# EasyEDA Pro project Batman_Forever_JAMMA_Adapter_V1.2.eprj

# Schematic Batman_Adapter
Board Name: Batman_Adapter; Create Date: 2026-03-11; Page Name: Batman_Adapter; Project Name: Batman_Forever_JAMMA_Adapter_V1.2; Schematic Name: Batman_Adapter; Update Date: 2026-03-10; File: Batman_Adapter; Id: /; Sheet: /
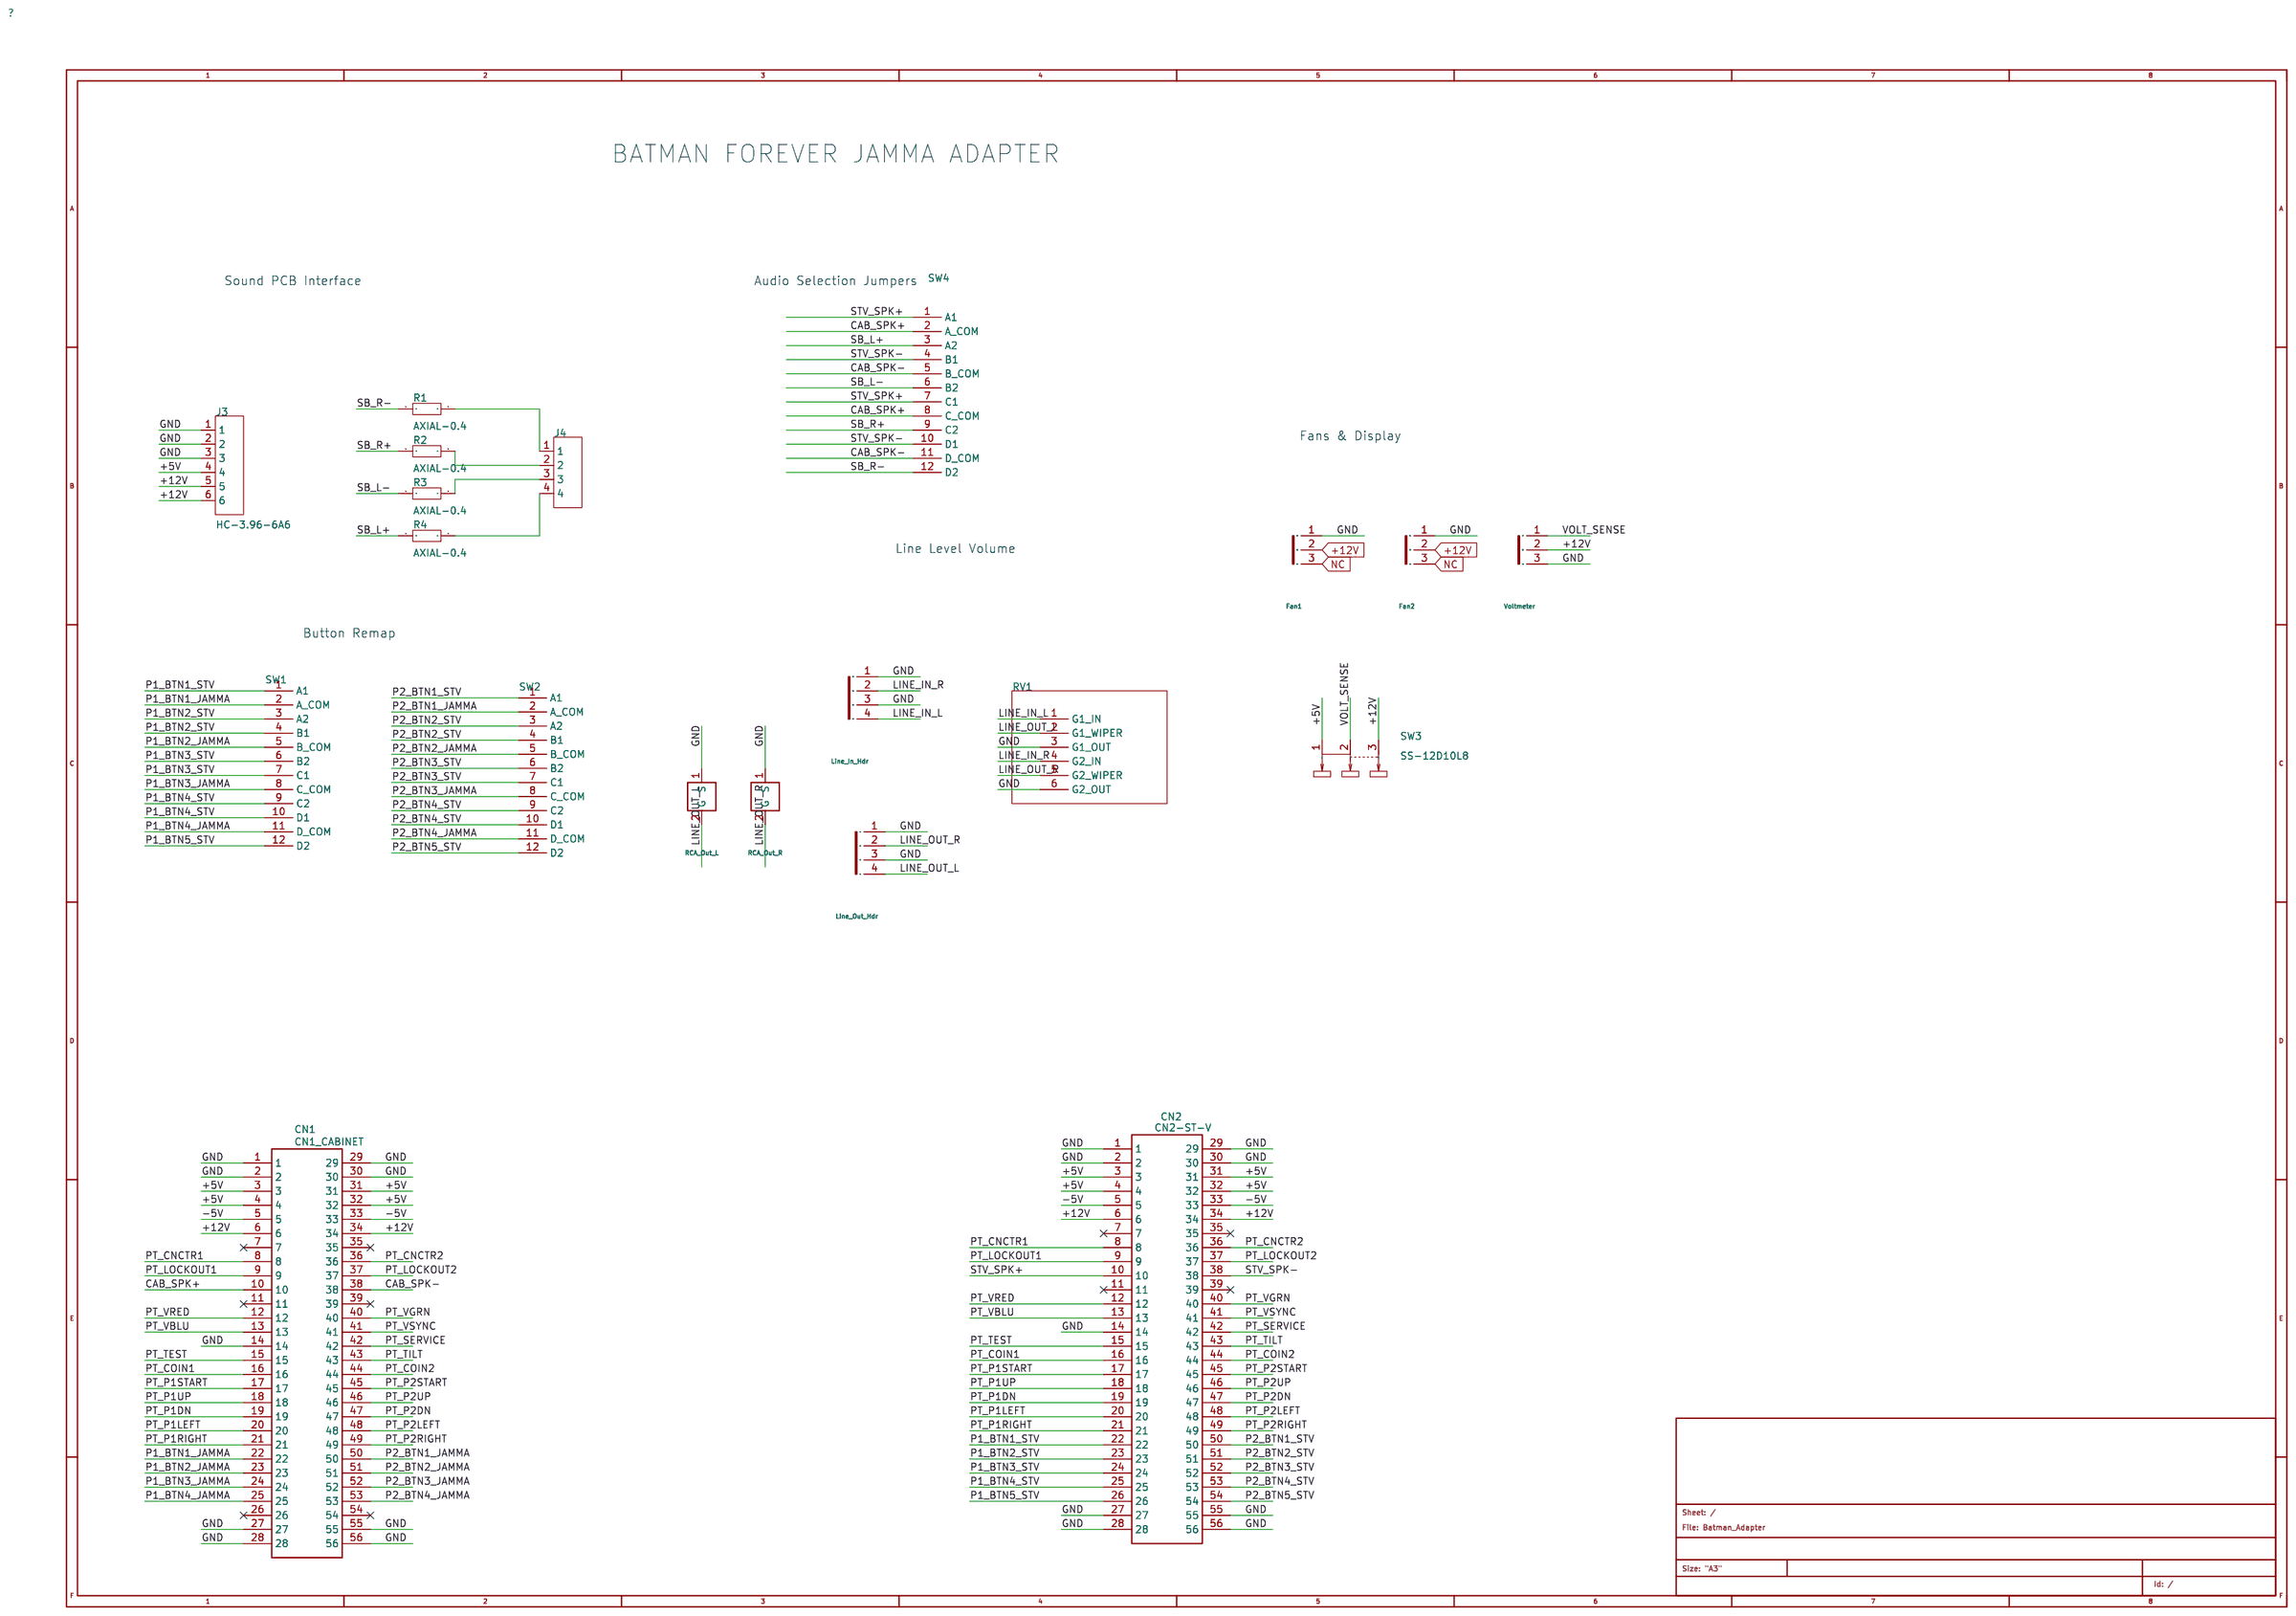
[diagram p0: schematic sheet]

## Parts
CN1  CN1_CABINET  [jamma gold fingers]
CN2  CN2-ST-V  [jamma gold fingers]
J3  HC-3.96-6A6  [CONN-TH_6P-P3.96_HCTL_HC-3.96-6A6]
J4  SIP4  [CONN-TH_4P-P3.96_MOLEX_26481045]
J7  RCA_Out_L  [CONN-TH_KLPX-0848A-2-B]
J8  RCA_Out_R  [CONN-TH_KLPX-0848A-2-B]
J9  Line_In_Hdr  [CONN-TH_4P-P2.54_22232041]
J10  Line_Out_Hdr  [CONN-TH_4P-P2.54_22232041]
J14  Fan1  [CONN-TH_3P-P2.54_22-23-2031]
J15  Fan2  [CONN-TH_3P-P2.54_22-23-2031]
J16  Voltmeter  [HDR-TH_3P-P2.54-V-M-B]
R1  AXIAL-0.4  [RES-TH_BD2.7-L8.8-P12.80-D0.5]
R2  AXIAL-0.4  [RES-TH_BD2.7-L8.8-P12.80-D0.5]
R3  AXIAL-0.4  [RES-TH_BD2.7-L8.8-P12.80-D0.5]
R4  AXIAL-0.4  [RES-TH_BD2.7-L8.8-P12.80-D0.5]
RV1  -  [RV16A01F_DUAL_POT_6P]
SW1  -  [SW_4PDT_SLIDE_12PIN]
SW2  -  [SW_4PDT_SLIDE_12PIN]
SW3  SS-12D10L8  [SW-TH_SS-12D10L8]
SW4  -  [SW_4PDT_SLIDE_12PIN]

## Library data of the parts
CN1 CN2 = 805-56P 56 PIN 3.96MM PITCH PCB CARD EDGE CONNECTOR COPY: Manufacturer: Yootop; link: https://www.amazon.com/gp/product/B07CZYQC34/ref=ppx_yo_dt_b_asin_title_o03_s00?ie=UTF8&psc=1; Contributor: bugwhacker99; spicePre: C
J3 = HC-3.96-6A6: Pins Structure:1x6P Pitch:3.96mm Mounting Type:Through Hole Reference Series:CH Number of Pins:6P Number of Rows:1 Number of PINs Per Row:6 Row Spacing:- Current Rating:6A Contact Material:Brass Contact Plating:Tin Operating Temperature:-25℃~+85℃ Operatin; LCSC Part Name: 1x6P 间距:3.96mm 直插 系列:CH; Supplier Part: C2979533; Manufacturer: HCTL(华灿天禄); Supplier Footprint: 插件,P=3.96mm; JLCPCB Part Class: Extended Part; Datasheet: https://item.szlcsc.com/datasheet/HC-3.96-6A6/3397490.html; Supplier: LCSC; Pins Structure: 1x6P; Pitch: 3.96mm; Mounting Type: Through Hole; Reference Series: CH; Number of Pins: 6P; Number of Rows: 1; Number of PINs Per Row: 6; Current Rating: 6A; Contact Material: Brass; Contact Plating: Tin; Operating Temperature: -25℃~+85℃; Voltage Rating: 250V; Plastic Material: PA66; Flame Retardant Rating: UL94V-0; Z-Height of the Board: 12.3mm; X-Length of Bottom Edge on Board (Spacing Line): 23.76mm; Y-Width of Bottom Edge on Board: 9.3mm
J4 = SIP4: Supplier Part: C9900010184; Supplier Footprint: HDR-TH_4P-P2.54; JLCPCB Part Class: Extended Part; Supplier: LCSC
J7 J8 = Connector_AudioJack2
J9 J10 = Connector_Conn_01x04_Pin
J14-J16 = Connector_Conn_01x03_Pin
R1-R4 = AXIAL-0.4: Supplier Part: C9900024059; Supplier Footprint: AXIAL; JLCPCB Part Class: Extended Part; Supplier: LCSC
RV1 = RV_DUAL_POT_6P
SW1 SW2 SW4 = SW_4PDT_SLIDE
SW3 = SS-12D10L8: Actuator Style:Rectangular Columnar Termination Style:PC Pin Length:12.9mm Width:6.9mm Mounting Type:Through Hole Actuator Color:Black Current Rating:1A Voltage Rating:250V Life:10,000 Cycles; Supplier Part: C5146673; Manufacturer: XKB Connection(中国星坤); JLCPCB Part Class: Extended Part; Datasheet: https://item.szlcsc.com/datasheet/SS-12D10L8/5769382.html; Supplier: LCSC; Actuator Style: Rectangular Columnar; Termination Style: PC Pin; Length: 12.9mm; Width: 6.9mm; Mounting Type: Through Hole; Actuator Color: Black; Current Rating: 1A; Voltage Rating: 250V; Life: 10,000 Cycles

## Nets
+5V: CN1.3 CN1.4 CN1.31 CN1.32 CN2.3 CN2.4 CN2.31 CN2.32 J3.4 SW3.1
+12V: CN1.6 CN1.34 CN2.6 CN2.34 J3.5 J3.6 J14.2(Pin) J15.2(Pin) J16.2(Pin) SW3.3
-5V: CN1.5 CN1.33 CN2.5 CN2.33
GND: CN1.1 CN1.2 CN1.14 CN1.27 CN1.28 CN1.29 CN1.30 CN1.55 CN1.56 CN2.1 CN2.2 CN2.14 CN2.27 CN2.28 CN2.29 CN2.30 CN2.55 CN2.56 J3.1 J3.2 J3.3 J7.1(S) J8.1(S) J9.1(Pin) J9.3(Pin) J10.1(Pin) J10.3(Pin) J14.1(Pin) J15.1(Pin) J16.3(Pin) RV1.3(G1_OUT) RV1.6(G2_OUT)
CAB_SPK+: CN1.10 SW4.2(A_COM) SW4.8(C_COM)
CAB_SPK-: CN1.38 SW4.5(B_COM) SW4.11(D_COM)
LINE_IN_L: J9.4(Pin) RV1.1(G1_IN)
LINE_IN_R: J9.2(Pin) RV1.4(G2_IN)
LINE_OUT_L: J7.2(G) J10.4(Pin) RV1.2(G1_WIPER)
LINE_OUT_R: J8.2(G) J10.2(Pin) RV1.5(G2_WIPER)
NC: J14.3(Pin) J15.3(Pin)
P1_BTN1_JAMMA: CN1.22 SW1.2(A_COM)
P1_BTN1_STV: CN2.22 SW1.1(A1)
P1_BTN2_JAMMA: CN1.23 SW1.5(B_COM)
P1_BTN2_STV: CN2.23 SW1.3(A2) SW1.4(B1)
P1_BTN3_JAMMA: CN1.24 SW1.8(C_COM)
P1_BTN3_STV: CN2.24 SW1.6(B2) SW1.7(C1)
P1_BTN4_JAMMA: CN1.25 SW1.11(D_COM)
P1_BTN4_STV: CN2.25 SW1.9(C2) SW1.10(D1)
P1_BTN5_STV: CN2.26 SW1.12(D2)
P2_BTN1_JAMMA: CN1.50 SW2.2(A_COM)
P2_BTN1_STV: CN2.50 SW2.1(A1)
P2_BTN2_JAMMA: CN1.51 SW2.5(B_COM)
P2_BTN2_STV: CN2.51 SW2.3(A2) SW2.4(B1)
P2_BTN3_JAMMA: CN1.52 SW2.8(C_COM)
P2_BTN3_STV: CN2.52 SW2.6(B2) SW2.7(C1)
P2_BTN4_JAMMA: CN1.53 SW2.11(D_COM)
P2_BTN4_STV: CN2.53 SW2.9(C2) SW2.10(D1)
P2_BTN5_STV: CN2.54 SW2.12(D2)
PT_CNCTR1: CN1.8 CN2.8
PT_CNCTR2: CN1.36 CN2.36
PT_COIN1: CN1.16 CN2.16
PT_COIN2: CN1.44 CN2.44
PT_LOCKOUT1: CN1.9 CN2.9
PT_LOCKOUT2: CN1.37 CN2.37
PT_P1DN: CN1.19 CN2.19
PT_P1LEFT: CN1.20 CN2.20
PT_P1RIGHT: CN1.21 CN2.21
PT_P1START: CN1.17 CN2.17
PT_P1UP: CN1.18 CN2.18
PT_P2DN: CN1.47 CN2.47
PT_P2LEFT: CN1.48 CN2.48
PT_P2RIGHT: CN1.49 CN2.49
PT_P2START: CN1.45 CN2.45
PT_P2UP: CN1.46 CN2.46
PT_SERVICE: CN1.42 CN2.42
PT_TEST: CN1.15 CN2.15
PT_TILT: CN1.43 CN2.43
PT_VBLU: CN1.13 CN2.13
PT_VGRN: CN1.40 CN2.40
PT_VRED: CN1.12 CN2.12
PT_VSYNC: CN1.41 CN2.41
SB_L+: R4.1 SW4.3(A2)
SB_L-: R3.1 SW4.6(B2)
SB_R+: R2.1 SW4.9(C2)
SB_R-: R1.1 SW4.12(D2)
STV_SPK+: CN2.10 SW4.1(A1) SW4.7(C1)
STV_SPK-: CN2.38 SW4.4(B1) SW4.10(D1)
VOLT_SENSE: J16.1(Pin) SW3.2
$1N7087: J4.1 R1.2
$1N7092: J4.2 R2.2
$1N7097: J4.3 R3.2
$1N7102: J4.4 R4.2

Not connected (* = marked no-connect by the designer): CN1 7* 11* 26* 35* 39* 54*; CN2 7* 11* 35* 39*

## Notes on the sheet
- BATMAN FOREVER JAMMA ADAPTER
- Sound PCB Interface
- Audio Selection Jumpers
- Fans & Display
- Line Level Volume
- Button Remap

# Schematic jamma edge connector
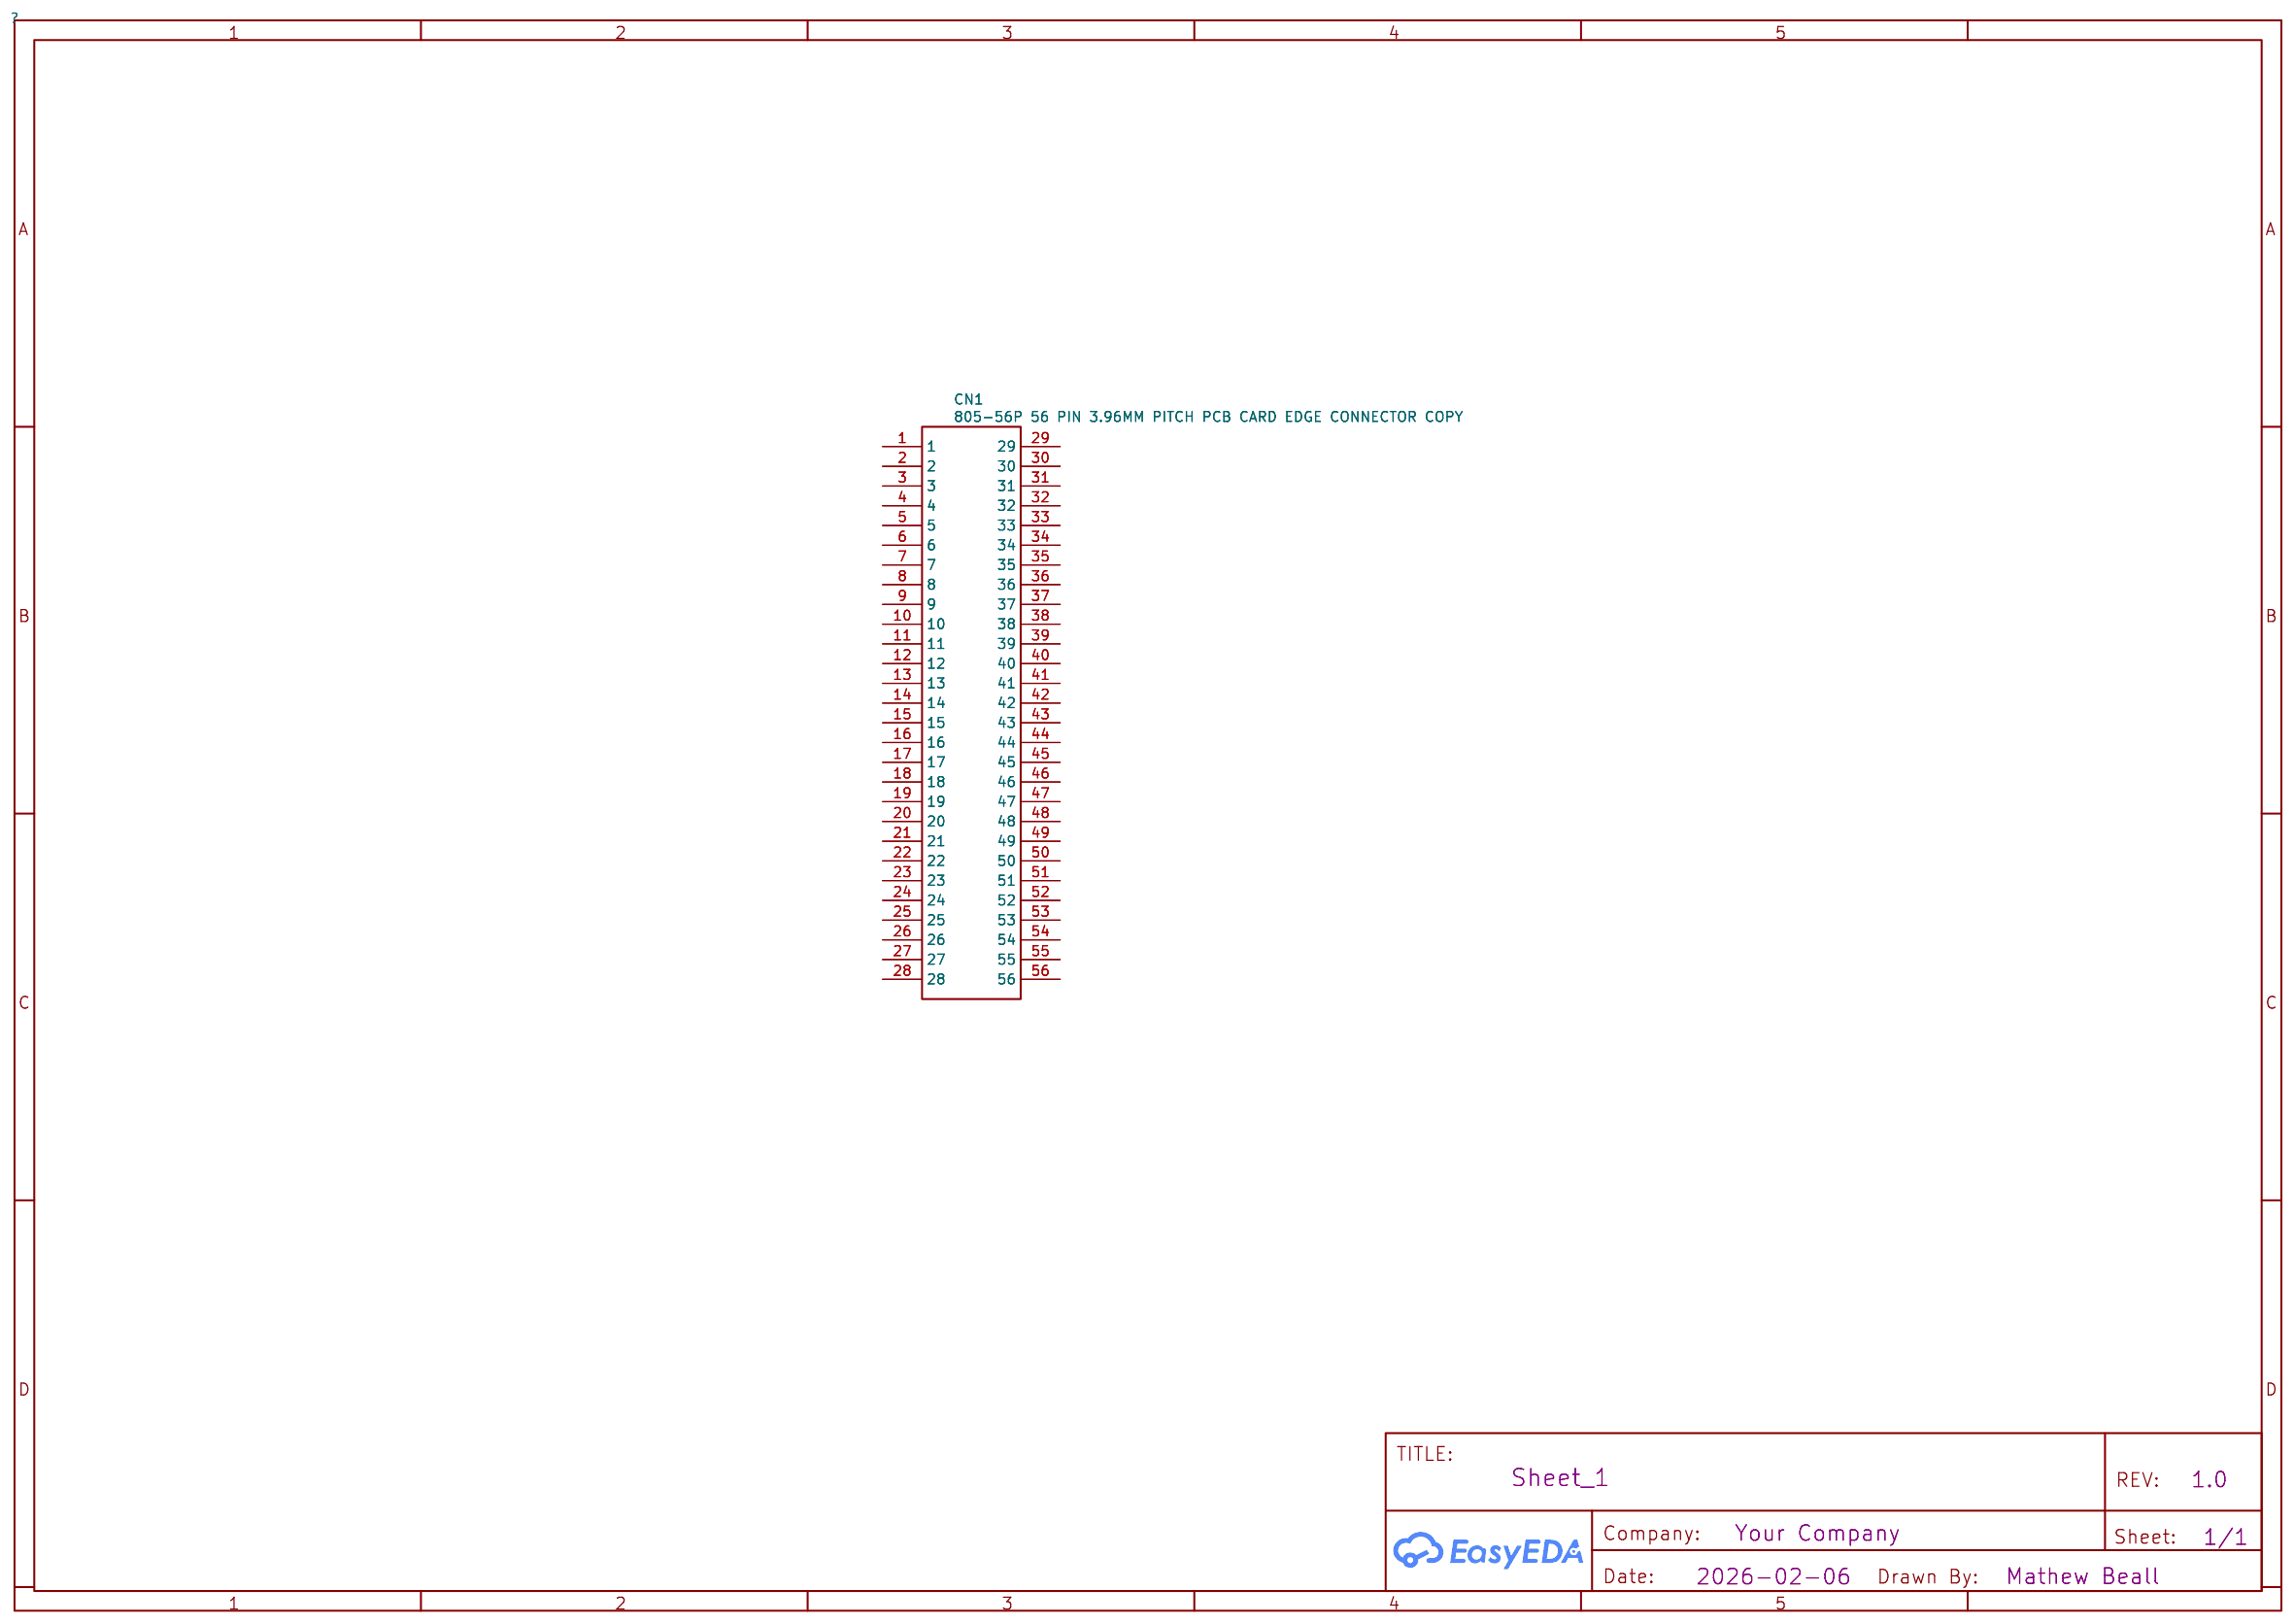
[diagram p1: schematic sheet]

## Parts
CN1  805-56P 56 PIN 3.96MM PITCH PCB CARD EDGE CONNECTOR COPY

## Library data of the parts
CN1 = 805-56P 56 PIN 3.96MM PITCH PCB CARD EDGE CONNECTOR COPY: Manufacturer: Yootop; link: https://www.amazon.com/gp/product/B07CZYQC34/ref=ppx_yo_dt_b_asin_title_o03_s00?ie=UTF8&psc=1; Contributor: bugwhacker99; spicePre: C

## Nets

Not connected (* = marked no-connect by the designer): CN1 1 2 3 4 5 6 7 8 9 10 11 12 13 14 15 16 17 18 19 20 21 22 23 24 25 26 27 28 29 30 31 32 33 34 35 36 37 38 39 40 41 42 43 44 45 46 47 48 49 50 51 52 53 54 55 56

# Board PCB_Jamma-Edge-Connector-pads-2_2026-02-07
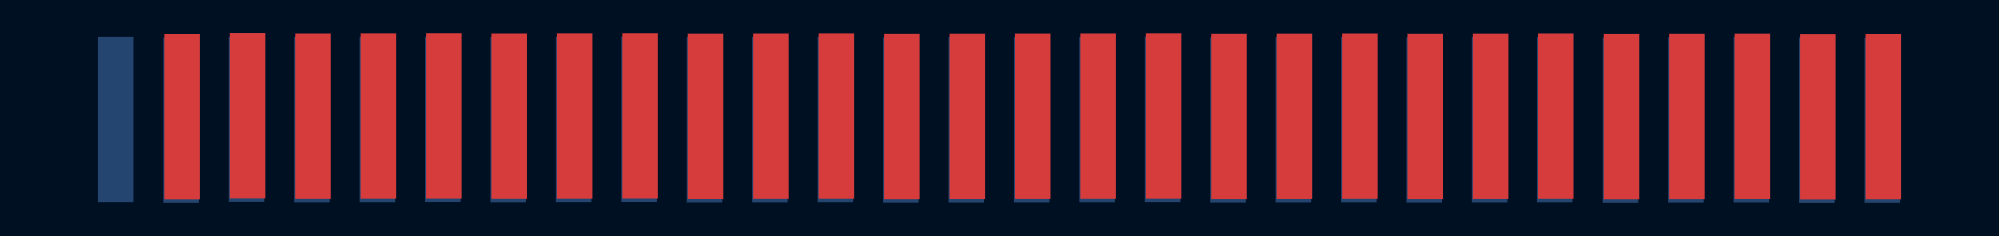
[diagram p2: board, top side]
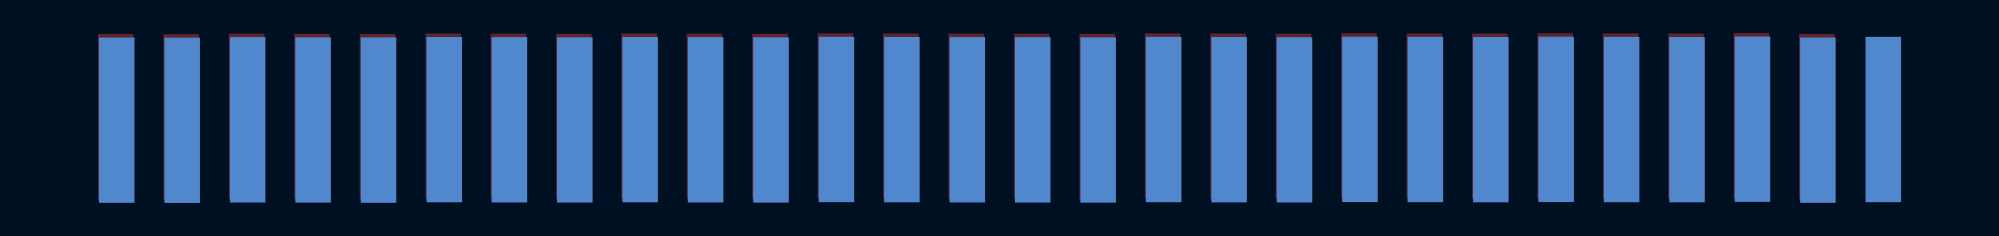
[diagram p3: board, bottom side, seen from below]

No outline. copper layers: Top Layer, Bottom Layer. Coordinates in mm from the lowest, leftmost part position.

## Design rules (mm)
via Default (default): diameter min 0.61, default 0.61, max 100.025; hole min 0.305, default 0.305, max 59.995

## Placement (name value [footprint] x y rotation side)
NOREF  -  [Pad_e31]  11.94 0.25 0 top
NOREF#2  -  [Pad_e15]  55.43 0.03 0 top
NOREF#3  -  [Pad_e29]  4.02 0.22 0 top
NOREF#4  -  [Pad_e4]  11.88 0.04 0 top
NOREF#5  -  [Pad_e45]  67.37 0.23 0 top
NOREF#6  -  [Pad_e5]  15.84 0.05 0 top
NOREF#7  -  [Pad_e42]  55.49 0.24 0 top
NOREF#8  -  [Pad_e17]  63.35 0.05 0 top
NOREF#9  -  [Pad_e36]  31.73 0.27 0 top
NOREF#10  -  [Pad_e13]  47.51 0.02 0 top
NOREF#11  -  [Pad_e41]  51.53 0.24 0 top
NOREF#12  -  [Pad_e16]  59.39 0.04 0 top
NOREF#13  -  [Pad_e55]  106.96 0.22 0 top
NOREF#14  -  [Pad_e34]  23.81 0.25 0 top
NOREF#15  -  [Pad_e48]  79.24 0.23 0 top
NOREF#16  -  [Pad_e53]  99.04 0.24 0 top
NOREF#17  -  [Pad_e25]  95.02 0.02 0 top
NOREF#18  -  [Pad_e37]  35.69 0.24 0 top
NOREF#19  -  [Pad_e28]  106.9 0.01 0 top
NOREF#20  -  [Pad_e9]  31.67 0.06 0 top
NOREF#21  -  [Pad_e8]  27.71 0.05 0 top
NOREF#22  -  [Pad_e26]  98.98 0.03 0 top
NOREF#23  -  [Pad_e43]  59.45 0.25 0 top
NOREF#24  -  [Pad_e12]  43.55 0.04 0 top
NOREF#25  -  [Pad_e14]  51.47 0.03 0 top
NOREF#26  -  [Pad_e24]  91.06 0.01 0 top
NOREF#27  -  [Pad_e3]  7.92 0.06 0 top
NOREF#28  -  [Pad_e2]  3.96 0.01 0 top
NOREF#29  -  [Pad_e11]  39.59 0.04 0 top
NOREF#30  -  [Pad_e7]  23.75 0.04 0 top
NOREF#31  -  [Pad_e35]  27.77 0.26 0 top
NOREF#32  -  [Pad_e49]  83.2 0.24 0 top
NOREF#33  -  [Pad_e44]  63.41 0.26 0 top
NOREF#34  -  [Pad_e40]  47.57 0.23 0 top
NOREF#35  -  [Pad_e21]  79.18 0.02 0 top
NOREF#36  -  [Pad_e1]  0 0.05 0 top
NOREF#37  -  [Pad_e38]  39.65 0.25 0 top
NOREF#38  -  [Pad_e52]  95.08 0.23 0 top
NOREF#39  -  [Pad_e18]  67.31 0.02 0 top
NOREF#40  -  [Pad_e32]  15.9 0.26 0 top
NOREF#41  -  [Pad_e10]  35.63 0.03 0 top
NOREF#42  -  [Pad_e33]  19.86 0.27 0 top
NOREF#43  -  [Pad_e23]  87.08 0.04 0 top
NOREF#44  -  [Pad_e22]  83.14 0.03 0 top
NOREF#45  -  [Pad_e19]  71.27 0.03 0 top
NOREF#46  -  [Pad_e30]  7.98 0.28 0 top
NOREF#47  -  [Pad_e39]  43.61 0.26 0 top
NOREF#48  -  [Pad_e27]  102.94 0 0 top
NOREF#49  -  [Pad_e51]  91.12 0.22 0 top
NOREF#50  -  [Pad_e54]  103 0.21 0 top
NOREF#51  -  [Pad_e20]  75.23 0.04 0 top
NOREF#52  -  [Pad_e6]  19.8 0.05 0 top
NOREF#53  -  [Pad_e47]  75.29 0.25 0 top
NOREF#54  -  [Pad_e46]  71.33 0.24 0 top
NOREF#55  -  [Pad_e50]  87.14 0.25 0 top

## Footprints (pads in the part's own frame, mm; a bottom-side part is the same pattern mirrored in y, then rotated)
Pad_e1
  rect 2.15x10 smd far side: 1(0,0)
Pad_e2
  rect 2.15x10 smd far side: 2(0,0)
Pad_e3
  rect 2.15x10 smd far side: 3(0,0)
Pad_e4
  rect 2.15x10 smd far side: 4(0,0)
Pad_e5
  rect 2.15x10 smd far side: 5(0,0)
Pad_e6
  rect 2.15x10 smd far side: 6(0,0)
Pad_e7
  rect 2.15x10 smd far side: 7(0,0)
Pad_e8
  rect 2.15x10 smd far side: 8(0,0)
Pad_e9
  rect 2.15x10 smd far side: 9(0,0)
Pad_e10
  rect 2.15x10 smd far side: 10(0,0)
Pad_e11
  rect 2.15x10 smd far side: 11(0,0)
Pad_e12
  rect 2.15x10 smd far side: 12(0,0)
Pad_e13
  rect 2.15x10 smd far side: 13(0,0)
Pad_e14
  rect 2.15x10 smd far side: 14(0,0)
Pad_e15
  rect 2.15x10 smd far side: 15(0,0)
Pad_e16
  rect 2.15x10 smd far side: 16(0,0)
Pad_e17
  rect 2.15x10 smd far side: 17(0,0)
Pad_e18
  rect 2.15x10 smd far side: 18(0,0)
Pad_e19
  rect 2.15x10 smd far side: 19(0,0)
Pad_e20
  rect 2.15x10 smd far side: 20(0,0)
Pad_e21
  rect 2.15x10 smd far side: 21(0,0)
Pad_e22
  rect 2.15x10 smd far side: 22(0,0)
Pad_e23
  rect 2.15x10 smd far side: 23(0,0)
Pad_e24
  rect 2.15x10 smd far side: 24(0,0)
Pad_e25
  rect 2.15x10 smd far side: 25(0,0)
Pad_e26
  rect 2.15x10 smd far side: 26(0,0)
Pad_e27
  rect 2.15x10 smd far side: 27(0,0)
Pad_e28
  rect 2.15x10 smd far side: 28(0,0)
Pad_e29
  rect 2.15x10 smd: 2(0,0)
Pad_e30
  rect 2.15x10 smd: 3(0,0)
Pad_e31
  rect 2.15x10 smd: 4(0,0)
Pad_e32
  rect 2.15x10 smd: 5(0,0)
Pad_e33
  rect 2.15x10 smd: 6(0,0)
Pad_e34
  rect 2.15x10 smd: 7(0,0)
Pad_e35
  rect 2.15x10 smd: 8(0,0)
Pad_e36
  rect 2.15x10 smd: 9(0,0)
Pad_e37
  rect 2.15x10 smd: 10(0,0)
Pad_e38
  rect 2.15x10 smd: 11(0,0)
Pad_e39
  rect 2.15x10 smd: 12(0,0)
Pad_e40
  rect 2.15x10 smd: 13(0,0)
Pad_e41
  rect 2.15x10 smd: 14(0,0)
Pad_e42
  rect 2.15x10 smd: 15(0,0)
Pad_e43
  rect 2.15x10 smd: 16(0,0)
Pad_e44
  rect 2.15x10 smd: 17(0,0)
Pad_e45
  rect 2.15x10 smd: 18(0,0)
Pad_e46
  rect 2.15x10 smd: 19(0,0)
Pad_e47
  rect 2.15x10 smd: 20(0,0)
Pad_e48
  rect 2.15x10 smd: 21(0,0)
Pad_e49
  rect 2.15x10 smd: 22(0,0)
Pad_e50
  rect 2.15x10 smd: 23(0,0)
Pad_e51
  rect 2.15x10 smd: 24(0,0)
Pad_e52
  rect 2.15x10 smd: 25(0,0)
Pad_e53
  rect 2.15x10 smd: 26(0,0)
Pad_e54
  rect 2.15x10 smd: 27(0,0)
Pad_e55
  rect 2.15x10 smd: 28(0,0)

## Nets

Pads without a net: NOREF 4; NOREF#2 15; NOREF#3 2; NOREF#4 4; NOREF#5 18; NOREF#6 5; NOREF#7 15; NOREF#8 17; NOREF#9 9; NOREF#10 13; NOREF#11 14; NOREF#12 16; NOREF#13 28; NOREF#14 7; NOREF#15 21; NOREF#16 26; NOREF#17 25; NOREF#18 10; NOREF#19 28; NOREF#20 9; NOREF#21 8; NOREF#22 26; NOREF#23 16; NOREF#24 12; NOREF#25 14; NOREF#26 24; NOREF#27 3; NOREF#28 2; NOREF#29 11; NOREF#30 7; NOREF#31 8; NOREF#32 22; NOREF#33 17; NOREF#34 13; NOREF#35 21; NOREF#36 1; NOREF#37 11; NOREF#38 25; NOREF#39 18; NOREF#40 5; NOREF#41 10; NOREF#42 6; NOREF#43 23; NOREF#44 22; NOREF#45 19; NOREF#46 3; NOREF#47 12; NOREF#48 27; NOREF#49 24; NOREF#50 27; NOREF#51 20; NOREF#52 6; NOREF#53 20; NOREF#54 19; NOREF#55 23

# Board PCB2
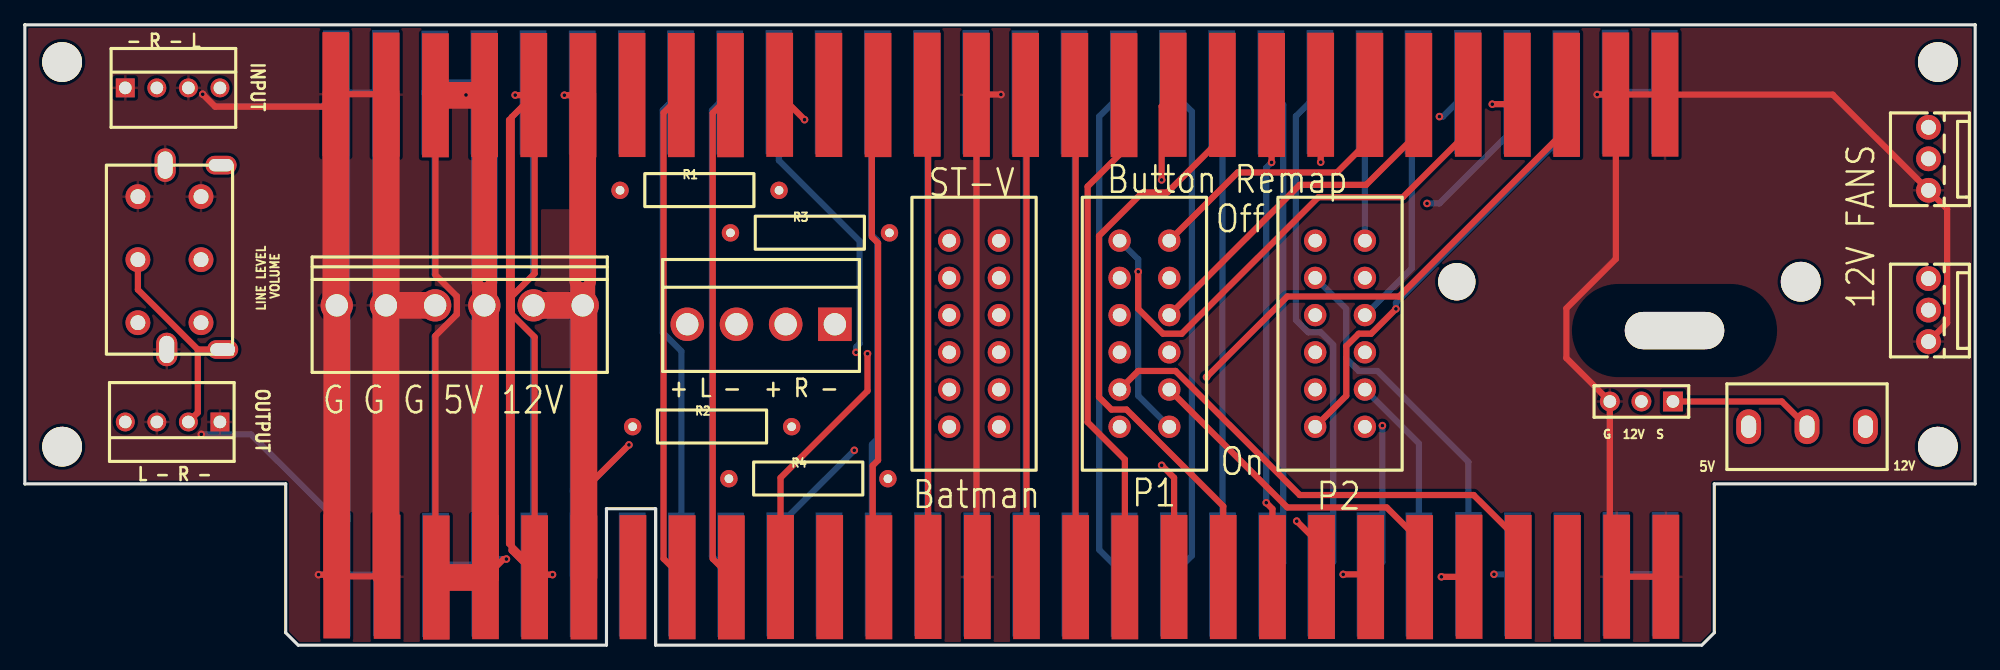
[diagram p4: board, top side]
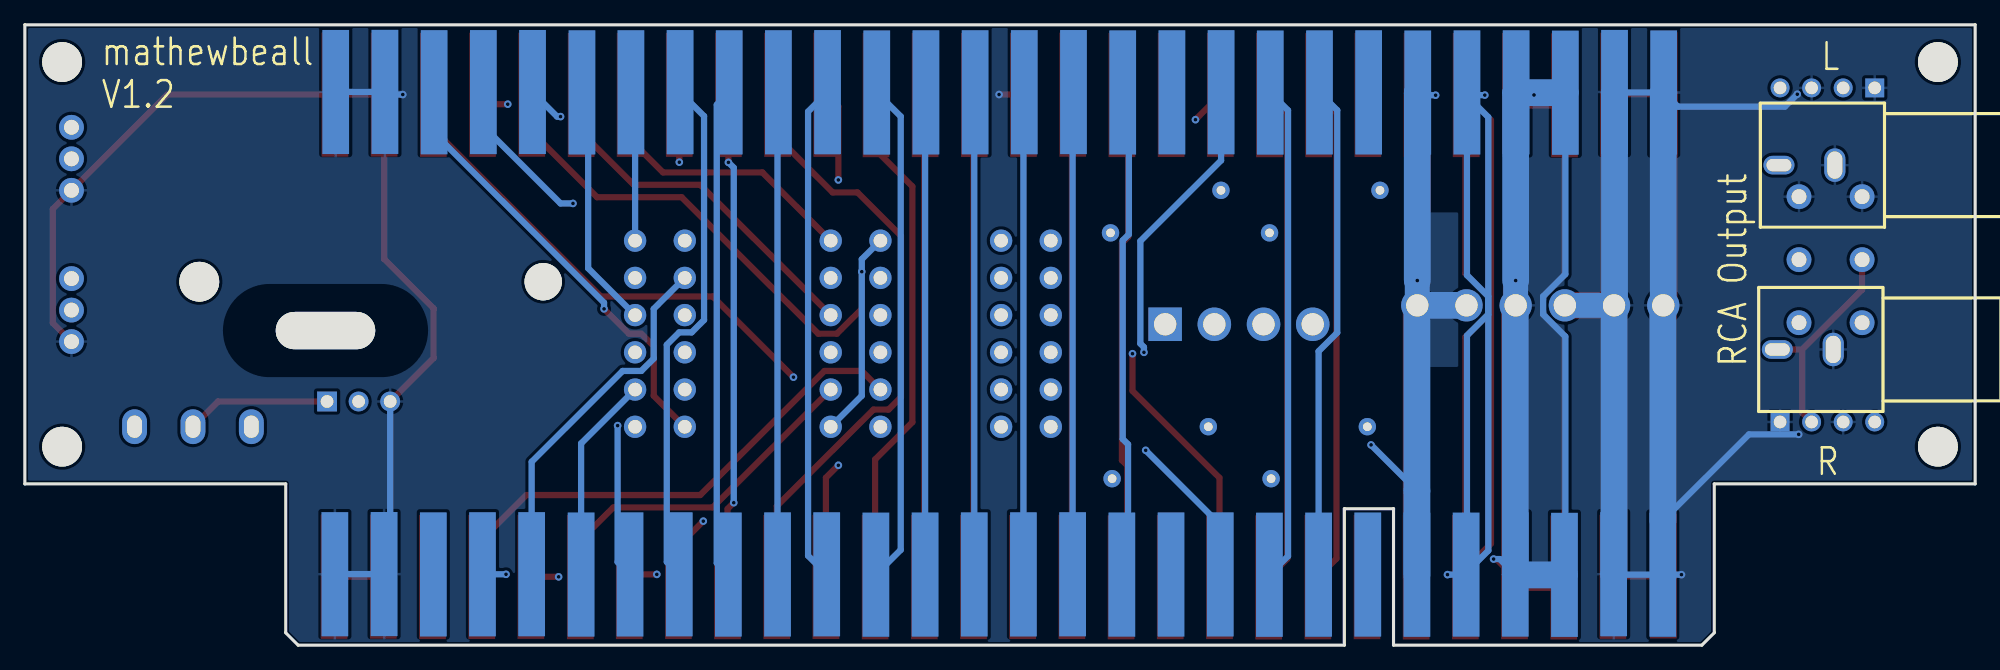
[diagram p5: board, bottom side, seen from below]

Outline 157 x 50 mm; copper layers: Top Layer, Inner1, Inner2, Bottom Layer. Coordinates in mm from the lower left corner of the outline.
Outline path: 0,50 157,50 157,13 136,13 136,1 135,0 50.78,0 50.78,11 46.82,11 46.82,0 22,0 21,1 21,13 0,13 0,50
Stack: Top Layer 0.035mm Outer layer thickness 1oz / Dielectric1 0.2104mm 7628 RC49% 8.6mil / Inner1 0.0152mm Inner layer thickness / Dielectric2 1.065mm 1.1mm H/HOZ Copper / Inner2 0.0152mm Inner layer thickness / Dielectric3 0.2104mm 7628 RC49% 8.6mil / Bottom Layer 0.035mm Outer layer thickness 1oz

## Design rules (mm)
template: Custom Config
spacing copperThickness1oz: track to track 0.102, other pairs 0.152 to 0.3
spacing copperThickness2oz (default): track to track 0.203, other pairs 0.152 to 0.3
track width copperThickness1oz: min 0.127, default 0.5, max 2.54
track width copperThickness2oz (default): min 0.203, default 0.5, max 2.54
differential pair differentialPair (default): width min 0.127, default 0.254, max 2.54; gap min 0.152, default 0.152
via viaSize (default): diameter min 0.5, default 0.61, max 10; hole min 0.3, default 0.305, max 6.3

## Placement (name value [footprint] x y rotation side)
12V  -  [SW-TH_SS-12D10L8]  143.47 17.61 0 top
CN1  CN1_CABINET  [jamma gold fingers]  83.34 86.7 180 top
CN2  CN2-ST-V  [jamma gold fingers]  83.27 125.56 180 top
G  12V  S  -  [HDR-TH_3P-P2.54-V-M-B]  130.13 19.64 0 top
J3  HC-3.96-6A6  [CONN-TH_6P-P3.96_HCTL_HC-3.96-6A6]  35.01 27.39 0 top
J4  SIP4  [CONN-TH_4P-P3.96_MOLEX_26481045]  59.27 25.86 0 top
J7  RCA_Out_L  [CONN-TH_KLPX-0848A-2-B]  13.55 38.69 0 bottom
J8  RCA_Out_R  [CONN-TH_KLPX-0848A-2-B]  13.67 23.83 0 bottom
J9  Line_In_Hdr  [CONN-TH_4P-P2.54_22232041]  11.89 44.92 0 top
J10  Line_Out_Hdr  [CONN-TH_4P-P2.54_22232041]  11.89 17.99 180 top
J14  Fan1  [CONN-TH_3P-P2.54_22-23-2031]  153.25 39.2 90 top
J15  Fan2  [CONN-TH_3P-P2.54_22-23-2031]  153.25 27.01 90 top
LINE LEVEL
  VOLUME  -  [RV16A01F_DUAL_POT_6P]  14.18 25.99 90 top
NOREF  -  [Pad_e75]  3 16 0 top
NOREF#2  -  [Pad_e77]  154 16 0 top
NOREF#3  -  [Pad_e72]  3 47 0 top
NOREF#4  -  [Pad_e93]  132.8 25.36 0 top
NOREF#5  -  [Pad_e83]  115.27 29.29 0 top
NOREF#6  -  [Pad_e76]  154 47 0 top
NOREF#7  -  [Pad_e85]  142.96 29.29 0 top
R1  AXIAL-0.4  [RES-TH_BD2.7-L8.8-P12.80-D0.5]  54.31 36.66 0 top
R2  AXIAL-0.4  [RES-TH_BD2.7-L8.8-P12.80-D0.5]  55.33 17.61 0 top
R3  AXIAL-0.4  [RES-TH_BD2.7-L8.8-P12.80-D0.5]  63.2 33.23 0 top
R4  AXIAL-0.4  [RES-TH_BD2.7-L8.8-P12.80-D0.5]  63.08 13.42 0 top
SW1  -  [SW_4PDT_SLIDE_12PIN]  485.1 798.53 270 top
SW2  -  [SW_4PDT_SLIDE_12PIN]  500.85 798.53 270 top
SW4  -  [SW_4PDT_SLIDE_12PIN]  471.38 798.53 270 top

## Footprints (pads in the part's own frame, mm; a bottom-side part is the same pattern mirrored in y, then rotated)
CONN-TH_3P-P2.54_22-23-2031
  round 2 hole 1.2: 1(-2.54,0) 2(0,0) 3(2.54,0)
CONN-TH_4P-P2.54_22232041
  rect 1.524x1.524 hole 1.02: 1(-3.81,0)
  round 1.524 hole 1.02: 2(-1.27,0) 3(1.27,0) 4(3.81,0)
CONN-TH_4P-P3.96_MOLEX_26481045
  rect 2.7x2.7 hole 1.8: 1(5.94,0)
  round 2.7 hole 1.8: 2(1.98,0) 3(-1.98,0) 4(-5.94,0)
CONN-TH_6P-P3.96_HCTL_HC-3.96-6A6
  round 2.6 hole 1.8: 1(-9.9,0) 2(-5.94,0) 3(-1.98,0) 4(1.98,0) 5(5.94,0) 6(9.9,0)
CONN-TH_KLPX-0848A-2-B
  oval 1.7x2.7 hole 1.2x2.2: 1(-2.25,0)
  oval 2.5x1.5 hole 2x1: 2(2.25,0)
HDR-TH_3P-P2.54-V-M-B
  rect 1.6x1.6 hole 1.02: 1(2.54,0)
  round 1.6 hole 1.02: 2(0,0) 3(-2.54,0)
jamma gold fingers
  rect 2.15x10 smd: 1(58.235,81.153) 2(54.175,81.186) 3(50.215,81.243) 4(46.256,81.216) 5(42.297,81.224) 6(38.337,81.233) 7(34.383,81.216) 8(30.422,81.225) 9(26.462,81.233) 10(22.503,81.206) 11(18.545,81.214) 12(14.584,81.222) 13(10.622,81.195) 14(6.661,81.204) 15(2.704,81.21) 16(-1.255,81.218) 17(-5.215,81.227) 18(-9.175,81.2) 19(-13.133,81.207) 20(-17.094,81.216) 21(-21.047,81.2) 22(-25.006,81.209) 23(-28.947,81.217) 24(-32.925,81.189) 25(-36.884,81.198) 26(-40.844,81.207) 27(-44.806,81.178) 28(-48.768,81.188)
  rect 2.15x10 smd far side: 29(58.196,81.013) 30(54.237,80.974) 31(50.277,81.031) 32(46.318,81.003) 33(42.36,81.011) 34(38.399,81.02) 35(34.445,81.004) 36(30.485,81.012) 37(26.524,81.021) 38(22.566,80.993) 39(18.607,81.001) 40(14.646,81.01) 41(10.684,80.982) 42(6.723,80.991) 43(2.766,80.998) 44(-1.193,81.006) 45(-5.153,81.014) 46(-9.113,80.987) 47(-13.071,80.996) 48(-17.032,81.004) 49(-20.985,80.987) 50(-24.944,80.996) 51(-28.884,81.005) 52(-32.863,80.977) 53(-36.822,80.986) 54(-40.782,80.995) 55(-44.744,80.966) 56(-48.706,80.975)
Pad_e72
  round 3.2 hole 3.2: 1(0,0)
Pad_e75
  round 3.2 hole 3.2: 3(0,0)
Pad_e76
  round 3.2 hole 3.2: 2(0,0)
Pad_e77
  round 3.2 hole 3.2: 4(0,0)
Pad_e83
  round 3 hole 3: VM1(0,0)
Pad_e85
  round 3.2 hole 3.2: VM2(0,0)
Pad_e93
  oval 8x3 hole 16x7: VM3(0,0)
RES-TH_BD2.7-L8.8-P12.80-D0.5
  round 1.4 hole 0.7: 1(-6.4,0) 2(6.4,0)
RV16A01F_DUAL_POT_6P
  round 2 hole 1.2: 1(0,0) 2(5.08,0) 3(10.16,0) 4(0,5.08) 5(5.08,5.08) 6(10.16,5.08)
SW-TH_SS-12D10L8
  oval 2x2.8 hole 1.2x1.8: 1(-4.7,0) 2(0,0) 3(4.7,0)
SW_4PDT_SLIDE_12PIN
  round 1.8 hole 1.1: 1(765.93,-392.97) 2(768.93,-392.97) 3(771.93,-392.97) 4(774.93,-392.97) 5(777.93,-392.97) 6(780.93,-392.97) 7(765.93,-396.97) 8(768.93,-396.97) 9(771.93,-396.97) 10(774.93,-396.97) 11(777.93,-396.97) 12(780.93,-396.97)

## Nets
As in the schematic, except:
+5V: 12V.1 CN1.3 CN1.4 CN1.31 CN1.32 CN2.3 CN2.4 CN2.31 CN2.32 J3.4
+12V: 12V.3 CN1.6 CN1.34 CN2.6 CN2.34 G  12V  S.2 J3.5 J3.6 J14.2 J15.2
GND: CN1.1 CN1.2 CN1.14 CN1.27 CN1.28 CN1.29 CN1.30 CN1.55 CN1.56 CN2.1 CN2.2 CN2.14 CN2.27 CN2.28 CN2.29 CN2.30 CN2.55 CN2.56 G  12V  S.3 J3.1 J3.2 J3.3 J7.1 J8.1 J9.1 J9.3 J10.1 J10.3 J14.1 J15.1 LINE LEVEL
  VOLUME.3 LINE LEVEL
  VOLUME.6
LINE_IN_L: J9.4 LINE LEVEL
  VOLUME.1
LINE_IN_R: J9.2 LINE LEVEL
  VOLUME.4
LINE_OUT_L: J7.2 J10.4 LINE LEVEL
  VOLUME.2
LINE_OUT_R: J8.2 J10.2 LINE LEVEL
  VOLUME.5
VOLT_SENSE: 12V.2 G  12V  S.1

Pads without a net: CN1 7 11 26 35 39 54; CN2 7 11 35 39; NOREF 3; NOREF#2 4; NOREF#3 1; NOREF#4 VM3; NOREF#5 VM1; NOREF#6 2; NOREF#7 VM2

## Via types
v1: diameter 0.61, hole 0.305, Top Layer to Bottom Layer, 33 vias

## Routing (per net, layer and track width the routed paths; a pad name or vN(x,y) marks a point on that pad's centre or on a via; arc(x,y) is an arc through that point)
+5V: length 308.3
  Top Layer w0.5: 33.15,5.48 33.12,5.45 33.05,5.52 33.05,24.94 34.78,26.66 34.78,28.11 33.05,29.84 CN2.3 33.08,44.34 ; v1(38.77,6.94) 38.54,6.94 CN1.4
  Top Layer w2: J3.4 37.01,27.41 CN2.4
  Top Layer w2.15: 33.12,5.45 37.05,5.45 CN1.4 37.08,27.3 J3.4 ; CN2.3 36.99,44.32 CN2.4
  Inner1 w0.5: 47.27,16.11 55.27,8.11 129.27,8.11 12V.1 ; 47.27,16.11 36.99,26.39 J3.4 v1(36.99,29.39) ; 47.27,16.11 38.77,7.61 v1(38.77,6.94)
  Bottom Layer w0.5: 33.09,5.69 CN1.31 32.99,5.74 32.99,24.88 34.78,26.66 34.78,28.11 32.99,29.9 CN2.31 33.18,44.34 ; CN1.32 38.27,6.94 v1(38.77,6.94)
  Bottom Layer w2: v1(36.99,29.39) J3.4
  Bottom Layer w2.15: J3.4 37.02,27.36 CN1.32 36.99,5.67 CN1.31 ; v1(36.99,29.39) 36.99,44.52 CN2.32 36.92,44.53 CN2.31
  vias: v1(35.51,44.34)
+12V: length 251.7
  Top Layer w0.5: CN2.6 v1(43.43,44.33) ; v1(48.63,16.14) 45,12.51
  Top Layer w2: 44.91,44.3 CN2.6 ; J3.6 v1(44.91,29.39)
  Top Layer w2.15: J3.5 J3.6 45,27.3 CN1.6 ; v1(44.91,29.39) 44.91,44.3
  Inner1 w0.5: J3.6 44.91,19.86 v1(48.63,16.14) 49.13,16.14 56.13,9.14 119.63,9.14 G  12V  S.2 ; J3.6 J3.5 ; J3.6 v1(44.91,29.39)
  Inner2 w0.5: G  12V  S.2 131.63,18.14 136.63,18.14 138.13,19.64 146.13,19.64 12V.3 148.17,21.93 J15.2 154.75,28.51 154.75,37.7 J14.2
  Bottom Layer w0.5: v1(48.63,16.14) 44.94,12.45 ; CN2.34 44.66,44.33 v1(43.43,44.33)
  Bottom Layer w2: J3.6 v1(44.91,29.39)
  Bottom Layer w2.15: CN2.34 44.91,44.5 v1(44.91,29.39) ; J3.5 J3.6 44.94,27.36 44.94,5.68
-5V: length 204.3
  Top Layer w0.5: 38.98,42.34 38.98,8.19 39.19,7.97 ; v1(42.48,5.69) 41.48,5.69 ; 41.48,5.69 41.04,6.12 ; 41.48,5.69 41.25,5.69 CN1.5 ; 39.19,7.97 39.19,42.56 CN2.5 ; 39.19,7.97 41.04,6.12 ; 39.19,7.97 39.19,7.62 41.04,5.77 41.04,6.12 ; CN2.5 v1(39.47,44.34) ; CN2.5 41.04,44.27 41.04,29.96 39.2,28.11 39.2,26.66 41.04,24.82 41.04,6.12
  Top Layer w1: 41.04,5.77 CN1.5
  Bottom Layer w0.5: 40.91,5.91 39.19,7.62 39.19,42.56 40.91,44.27 ; 40.91,5.91 40.91,24.95 39.2,26.66 39.2,28.11 40.91,29.82 40.91,44.27 ; 40.91,5.91 40.91,5.76 CN1.33 v1(42.48,5.69) ; v1(39.47,44.34) 40.7,44.34 CN2.33 40.91,44.27
GND: length 542.2
  Top Layer w0.5: CN1.28 132.1,5.52 CN1.27 127.59,6.07 G  12V  S.3 124.09,23.14 124.09,27.14 128.07,31.12 CN2.27 ; J15.1 154.75,25.97 154.75,35.16 J14.1 145.53,44.37 CN2.28 132.03,44.38 CN2.27 ; v1(23.64,5.68) 24.96,5.68 25.1,5.55 29.13,5.55 ; CN2.27 v1(126.57,44.38) ; v1(14.32,44.41) 15.32,43.41 24.03,43.41 CN2.1 29.06,44.41 CN2.2 ; v1(78.57,44.38) 76.63,44.38 CN2.14 76.61,5.56 CN1.14
  Top Layer w2.15: 25.1,5.55 25.11,5.55 J3.1 25.03,27.46 CN2.1 ; J3.2 J3.3 ; J3.2 29.09,27.41 CN2.2 ; J3.2 29.07,5.61 29.13,5.55
  Inner1 w0.5: 13.17,44.06 13.17,44.56 ; 13.17,44.06 13.17,43.06 11.3,41.19 J7.1 11.1,38.5 11.1,38.15 ; 13.17,44.06 12.67,43.56 9.44,43.56 J9.1 ; 13.17,44.56 14.17,44.56 v1(14.32,44.41) ; 13.17,44.56 J9.3 ; 11.2,17.99 12.7,16.49 13.7,16.49 v1(14.2,16.99) 15.2,17.99 J10.1 25.1,27.39 ; 11.2,17.99 11.2,23.61 J8.1 11.42,33.83 LINE LEVEL
  VOLUME.6 11.1,38.15 ; 11.2,17.99 J10.3 ; J3.1 J3.2 J3.3 50.02,44.38 v1(78.57,44.38) ; 11.1,38.15 12.18,38.15 LINE LEVEL
  VOLUME.3
  Inner2 w0.5: v1(126.57,44.38) v1(78.57,44.38)
  Bottom Layer w0.5: CN1.30 29.06,5.68 CN1.29 v1(23.64,5.68) ; CN2.30 28.99,44.55 CN2.29 23.93,43.41 15.32,43.41 v1(14.32,44.41) ; v1(14.2,16.99) 18.2,16.99 25.14,10.05 ; CN1.56 132.03,5.73 CN1.55 127.59,6.22 G  12V  S.3 ; CN2.56 131.97,44.59 CN2.55 127.8,44.38 v1(126.57,44.38)
  Bottom Layer w2: CN1.29 25.14,10.05 ; J3.2 J3.3
  Bottom Layer w2.15: CN1.30 29.07,5.76 J3.2 29.03,27.43 CN2.30 ; 25.14,10.06 25.14,27.36 J3.1 25.11,44.51 CN2.29
CAB_SPK+: length 34
  Top Layer w0.5: v1(67.83,23.49) 67.83,20.49 60.83,13.49 CN1.10
  Inner2 w0.5: v1(67.83,23.49) 68.3,23.49 74.41,29.6 78.41,29.6
CAB_SPK-: length 26.2
  Inner2 w0.5: v1(66.77,15.7) 69.51,15.7 74.41,20.6 78.41,20.6
  Bottom Layer w0.5: v1(66.77,15.7) 60.77,9.7 60.77,5.7
LINE_IN_L: length 21.2
  Inner2 w0.5: J9.4 17.68,42.94 17.68,29.49 LINE LEVEL
  VOLUME.1
LINE_IN_R: length 20.4
  Inner2 w0.5: J9.2 9.62,43.92 9.62,38.02 10.6,37.04 10.6,27.49 LINE LEVEL
  VOLUME.4
LINE_OUT_L: length 24.3
  Inner2 w0.5: J7.2 15.8,32.69 LINE LEVEL
  VOLUME.2 12.68,29.57 12.68,25.07 13.18,24.57 13.18,23.09 J10.4
LINE_OUT_R: length 17.4
  Top Layer w0.5: 13.92,23.83 13.92,18.75 J10.2 ; 13.92,23.83 J8.2 ; 13.92,23.83 9.1,28.66 LINE LEVEL
  VOLUME.5
NC: length 13.4
  Inner2 w0.5: J15.3 151.75,31.05 151.75,40.24 J14.3
P1_BTN1_JAMMA: length 32.9
  Top Layer w0.5: CN1.22 108.13,5.71 v1(106.13,5.71)
  Inner2 w0.5: 92.13,29.6 100.89,20.83 100.89,9.44 104.63,5.71 v1(106.13,5.71)
P1_BTN1_STV: length 23.1
  Top Layer w0.5: 92.13,32.6 97.63,38.1 105.63,38.1 108.28,40.75 CN2.22
P1_BTN2_JAMMA: length 28.2
  Top Layer w0.5: 92.13,20.6 101.63,11.1 109.63,11.1 112.28,8.45 CN1.23
P1_BTN2_STV: length 32.2
  Top Layer w0.5: CN2.23 112.22,41.34 107.98,37.1 102.63,37.1 92.13,26.6
  Inner2 w0.5: 92.13,26.6 92.13,23.6
P1_BTN3_JAMMA: length 46.5
  Top Layer w0.5: v1(114.03,5.51) CN1.24
  Inner2 w0.5: 88.13,29.6 89.63,28.1 89.63,15.1 100.13,4.6 113.13,4.6 v1(114.03,5.51)
P1_BTN3_STV: length 56.8
  Top Layer w0.5: CN2.24 115.93,44.1 115.93,41.1 110.93,36.1 104.13,36.1 93.13,25.1 91.63,25.1 89.63,27.1 v1(89.63,30.1)
  Bottom Layer w0.5: 88.13,32.6 89.63,31.1 v1(89.63,30.1) 89.63,20.1 92.13,17.6
P1_BTN4_JAMMA: length 41.4
  Top Layer w0.5: 88.13,20.6 89.63,22.1 92.63,22.1 102.63,12.1 116.63,12.1 120.22,8.51 CN1.25
P1_BTN4_STV: length 42.7
  Top Layer w0.5: v1(118.13,43.6) 119.39,43.6 120.15,44.36
  Inner1 w0.5: v1(118.13,43.6) 107.63,43.6 103.13,39.1 103.13,38.6 92.63,28.1 89.63,28.1 88.13,26.6
  Inner2 w0.5: 88.13,26.6 88.13,23.6
P1_BTN5_STV: length 48.7
  Top Layer w0.5: CN2.26 124.11,41.59 110.63,28.1 101.63,28.1 v1(95.13,21.6)
  Inner1 w0.5: v1(95.13,21.6) 92.63,19.1 89.63,19.1 88.13,17.6
P2_BTN1_JAMMA: length 24.9
  Inner2 w0.5: v1(109.28,17.7) 109.28,28.2 SW2.2
  Bottom Layer w0.5: v1(109.28,17.7) 109.28,6.7 CN1.50
P2_BTN1_STV: length 12.1
  Bottom Layer w0.5: SW2.1 107.88,44.23 CN2.50
P2_BTN2_JAMMA: length 16.7
  Bottom Layer w0.5: SW2.5 112.22,16.26 112.22,5.69
P2_BTN2_STV: length 22.7
  Inner2 w0.5: SW2.3 SW2.4
  Bottom Layer w0.5: 112.15,44.56 111.65,44.06 111.65,30.38 SW2.3
P2_BTN3_JAMMA: length 29.9
  Bottom Layer w0.5: CN1.52 116.2,14.78 108.88,22.1 107.38,22.1 106.38,23.1 106.38,27.1 SW2.8
P2_BTN3_STV: length 33.9
  Inner2 w0.5: SW2.6 105.38,20.1 105.38,31.1 SW2.7 v1(113.88,42.6)
  Bottom Layer w0.5: CN2.52 114.15,42.6 v1(113.88,42.6)
P2_BTN4_JAMMA: length 23
  Inner2 w0.5: SW2.11 103.88,19.6 117.77,5.71 v1(118.27,5.71)
  Bottom Layer w0.5: v1(118.27,5.71) CN1.53
P2_BTN4_STV: length 28.9
  Inner1 w0.5: SW2.9 103.88,27.6 107.38,31.1 108.38,31.1 v1(112.88,35.6)
  Inner2 w0.5: SW2.9 SW2.10
  Bottom Layer w0.5: CN2.53 119.88,44.36 119.88,41.6 113.88,35.6 v1(112.88,35.6)
P2_BTN5_STV: length 35.9
  Top Layer w0.5: SW2.12 106.38,20.1 106.38,24.1 107.38,25.1 108.38,25.1 v1(110.38,27.1)
  Bottom Layer w0.5: CN2.54 123.88,44.39 123.88,41.1 110.38,27.6 v1(110.38,27.1)
PT_CNCTR1: length 40.1
  Top Layer w0.5: CN1.8 51.42,6.97 51.42,42.91 CN2.8
PT_CNCTR2: length 40.1
  Bottom Layer w0.5: CN2.36 51.35,43.12 51.35,25.19 52.85,23.69 CN1.36
PT_COIN1: length 38.9
  Top Layer w0.5: CN1.16 84.59,44.27 CN2.16
PT_COIN2: length 38.9
  Bottom Layer w0.5: CN1.44 84.53,44.48 CN2.44
PT_LOCKOUT1: length 40.1
  Top Layer w0.5: 56.81,44.33 55.38,42.9 55.38,6.97 CN1.9
PT_LOCKOUT2: length 40.1
  Bottom Layer w0.5: CN1.37 55.31,7.18 55.31,43.11 CN2.37
PT_P1DN: length 49
  Top Layer w0.5: CN1.19 96.47,11.2 88.68,18.99 87.47,18.99 86.47,19.99 86.47,32.99 89.97,36.49 91.97,36.49 96.4,40.92 CN2.19
PT_P1LEFT: length 39.2
  Top Layer w0.5: v1(99.93,11.48) 100.43,10.98 CN1.20 ; v1(100.36,38.91) CN2.20
  Bottom Layer w0.5: v1(100.36,38.91) 99.93,38.48 v1(99.93,11.48)
PT_P1RIGHT: length 40.5
  Top Layer w0.5: v1(104.32,38.93) CN2.21 ; CN1.21 104.39,8 v1(102.39,10)
  Inner1 w0.5: v1(104.32,38.93) 104.32,37.93 102.39,36 v1(102.39,10)
PT_P1START: length 41.3
  Top Layer w0.5: CN1.17 88.55,14.97 85.55,17.97 85.55,36.97 88.48,39.9 CN2.17
PT_P1UP: length 40.5
  Top Layer w0.5: v1(91.51,37.5) 91.51,43.43 CN2.18 ; CN1.18 92.51,13.5 v1(91.51,14.5)
  Inner2 w0.5: v1(91.51,14.5) 90.51,15.5 90.51,36.5 v1(91.51,37.5)
PT_P2DN: length 38.9
  Bottom Layer w0.5: CN1.47 96.41,44.5 CN2.47
PT_P2LEFT: length 39.7
  Bottom Layer w0.5: CN1.48 101.3,6.62 101.3,43.56 CN2.48
PT_P2RIGHT: length 41.9
  Bottom Layer w0.5: CN1.49 105.32,6.71 105.32,24.21 104.32,25.21 103.32,25.21 102.32,26.21 102.32,42.64 CN2.49
PT_P2START: length 40.5
  Bottom Layer w0.5: CN2.45 86.49,42.61 86.49,7.68 CN1.45
PT_P2UP: length 40.1
  Bottom Layer w0.5: CN1.46 93.95,7.21 93.95,43 92.38,44.57
PT_SERVICE: length 38.9
  Bottom Layer w0.5: CN2.42 76.61,44.5 CN1.42
PT_TEST: length 38.9
  Top Layer w0.5: CN1.15 80.63,44.28 CN2.15
PT_TILT: length 38.9
  Bottom Layer w0.5: CN2.43 80.57,44.49 CN1.43
PT_VBLU: length 38.9
  Top Layer w0.5: CN2.13 72.72,44.3 CN1.13
PT_VGRN: length 39.7
  Bottom Layer w0.5: CN2.40 68.12,44.05 68.12,33.12 68.62,32.62 68.62,16.62 68.19,16.19 68.19,6.19 CN1.40
PT_VRED: length 39.7
  Top Layer w0.5: CN2.12 68.19,43.84 68.19,32.91 68.69,32.41 68.69,14.91 68.25,14.47 68.25,5.98 CN1.12
PT_VSYNC: length 38.9
  Bottom Layer w0.5: CN1.41 72.65,44.51 CN2.41
SB_L+: length 34.2
  Inner2 w0.5: R4.1 57.99,12.1 70.91,12.1 77.91,19.1 78.91,19.1 79.91,20.1 79.91,25.1 78.41,26.6
SB_L-: length 32.2
  Inner1 w0.5: R3.1 61.93,28.1 74.91,28.1 75.91,27.1 75.91,20.1 78.41,17.6
SB_R+: length 41.2
  Inner1 w0.5: R2.1 50.42,19.1 70.91,19.1 73.91,16.1 74.91,16.1 75.91,17.1 75.91,18.1 74.91,19.1 73.91,19.1 72.91,20.1 72.91,25.1 74.41,26.6
SB_R-: length 36.8
  Inner1 w0.5: R1.1 55.41,29.16 55.41,25.1 57.91,22.6 69.41,22.6 74.41,17.6
STV_SPK+: length 22.5
  Top Layer w0.5: CN2.10 v1(62.77,42.35)
  Inner2 w0.5: v1(62.77,42.35) 64.66,42.35 74.41,32.6 78.41,32.6
STV_SPK-: length 36.4
  Inner2 w0.5: v1(66.91,23.6) 66.91,23.1 67.41,22.6 73.41,22.6 74.41,23.6 78.41,23.6
  Bottom Layer w0.5: v1(66.91,23.6) 66.91,24.02 67.2,24.31 67.2,32.57 60.7,39.07 CN2.38
VOLT_SENSE: length 11.6
  Top Layer w0.5: 12V.2 141.44,19.64 G  12V  S.1
$1N7087: length 12.7
  Inner2 w0.5: J4.1 65.21,32.17 60.71,36.66
$1N7092: length 8.5
  Inner2 w0.5: J4.2 61.25,18.09 61.73,17.61
$1N7097: length 23.9
  Inner1 w0.5: R3.2 67.97,34.86 56.79,34.86 55.29,33.36 55.29,32.86 57.29,30.86 J4.3
$1N7102: length 22.2
  Inner2 w0.5: J4.4 53.33,24.36 64.27,13.42 R4.2

## Copper pours and planes (outline as drawn; the poured copper is in the pictures)
+5V on Top Layer: 32.99,43.74 37.3,43.74 37.3,5.93 32.99,5.93
+5V on Bottom Layer: 33.05,43.81 37.02,43.81 37.02,6.56 33.05,6.56
+12V on Top Layer: 41.04,35.14 44.94,35.14 44.94,22.32 41.04,22.32
+12V on Bottom Layer: 41.61,34.88 44.94,34.88 44.94,22.43 41.61,22.43
GND on Top Layer: -1.95,51.39 161.12,51.39 161.12,-1.95 -1.95,-1.95
GND on Bottom Layer: -2.84,52.28 162.26,52.28 162.26,-2.58 -2.84,-2.58
GND on Inner1: -2.08,51.65 161.25,51.65 161.25,-1.95 -2.08,-1.95

## Text on the board
Bottom Silkscreen Layer: RCA Output | L | R | mathewbeall / V1.2
Top Silkscreen Layer: 5V | - R - L | L - R - | INPUT | OUTPUT | + L -  + R - | G G G 5V 12V | Batman | ST-V | Button Remap | P1 | Off | On | P2 | 12V FANS
